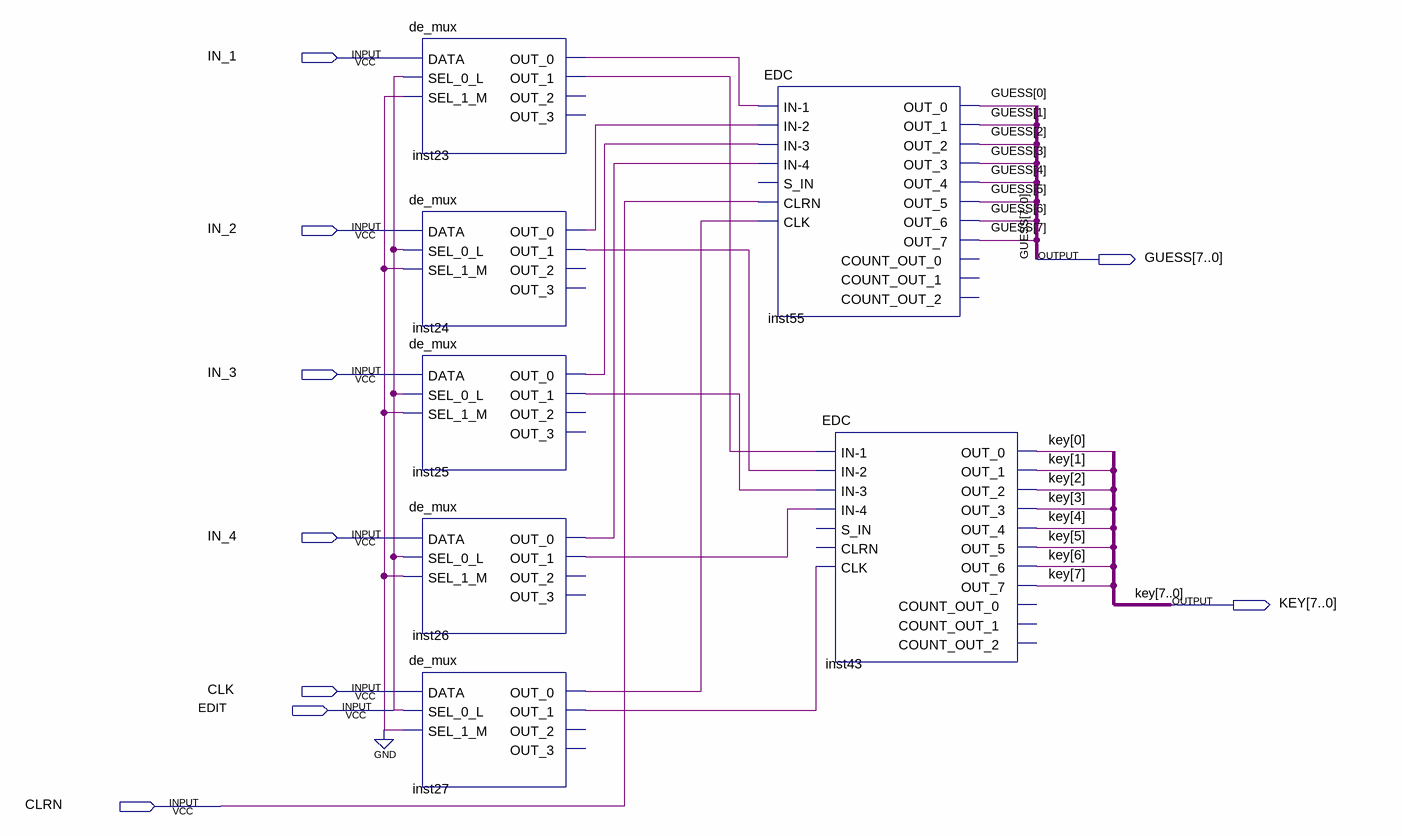
[diagram p0: schematic sheet]
// Quartus schematic reg_mk2.bdf as structural Verilog: 7 symbols, 9 pins
module reg_mk2 (
  input  IN_1,
  input  IN_2,
  input  IN_3,
  input  IN_4,
  input  CLK,
  input  EDIT,
  input  CLRN,
  output [7:0] GUESS,
  output [7:0] KEY
);

  wire inst23_out_0, inst23_out_1, inst24_out_0, inst24_out_1, inst25_out_0, inst25_out_1, inst26_out_0,
       inst26_out_1, inst27_out_0, inst27_out_1;

  de_mux inst23 (
    .DATA(IN_1), .SEL_0_L(EDIT), .SEL_1_M(1'b0), .OUT_0(inst23_out_0), .OUT_1(inst23_out_1));  // open: OUT_2, OUT_3
  de_mux inst24 (
    .DATA(IN_2), .SEL_0_L(EDIT), .SEL_1_M(1'b0), .OUT_0(inst24_out_0), .OUT_1(inst24_out_1));  // open: OUT_2, OUT_3
  de_mux inst25 (
    .DATA(IN_3), .SEL_0_L(EDIT), .SEL_1_M(1'b0), .OUT_0(inst25_out_0), .OUT_1(inst25_out_1));  // open: OUT_2, OUT_3
  de_mux inst26 (
    .DATA(IN_4), .SEL_0_L(EDIT), .SEL_1_M(1'b0), .OUT_0(inst26_out_0), .OUT_1(inst26_out_1));  // open: OUT_2, OUT_3
  de_mux inst27 (
    .DATA(CLK), .SEL_0_L(EDIT), .SEL_1_M(1'b0), .OUT_0(inst27_out_0), .OUT_1(inst27_out_1));  // open: OUT_2, OUT_3
  EDC inst55 (
    .\IN-1 (inst23_out_0), .\IN-2 (inst24_out_0), .\IN-3 (inst25_out_0), .\IN-4 (inst26_out_0), .CLRN(CLRN),
    .CLK(inst27_out_0), .OUT_0(GUESS[0]), .OUT_1(GUESS[1]), .OUT_2(GUESS[2]), .OUT_3(GUESS[3]),
    .OUT_4(GUESS[4]), .OUT_5(GUESS[5]), .OUT_6(GUESS[6]), .OUT_7(GUESS[7]));  // open: S_IN, COUNT_OUT_0, COUNT_OUT_1, COUNT_OUT_2
  EDC inst43 (
    .\IN-1 (inst23_out_1), .\IN-2 (inst24_out_1), .\IN-3 (inst25_out_1), .\IN-4 (inst26_out_1),
    .CLK(inst27_out_1), .OUT_0(KEY[0]), .OUT_1(KEY[1]), .OUT_2(KEY[2]), .OUT_3(KEY[3]), .OUT_4(KEY[4]),
    .OUT_5(KEY[5]), .OUT_6(KEY[6]), .OUT_7(KEY[7]));  // open: S_IN, CLRN, COUNT_OUT_0, COUNT_OUT_1, COUNT_OUT_2
endmodule
